# EAGLE design FUZZFACEA (EAGLE 8.6.3)
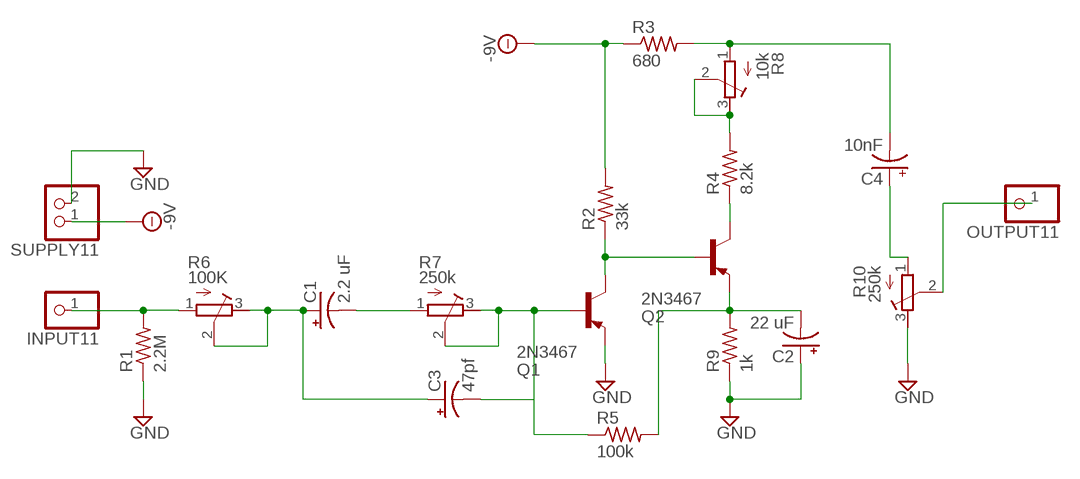
[diagram p0: schematic, sheet 1]

## Parts
C1  2.2 uF  CPOL-USTAP5-60  [TAP5-60]
C2  22 uF  CPOL-USTAP5-60  [TAP5-60]
C3  47pf  CPOL-USE2-4  [E2-4]
C4  10nF  CPOL-USE15-6AXIAL  [E15-6]
INPUT11  PINHD-1X1  [1X01]
OUTPUT11  PINHD-1X1  [1X01]
Q1  2N3467  [TO39]
Q2  2N3467  [TO39]
R1  2.2M  R-US_0411/12  [0411/12]
R2  33k  R-US_0411/12  [0411/12]
R3  680  R-US_0411/12  [0411/12]
R4  8.2k  R-US_0411/12  [0411/12]
R5  100k  R-US_0411/12  [0411/12]
R6  100K  R-TRIMM64X  [RTRIM64X]
R7  250k  R-TRIMM64X  [RTRIM64X]
R8  10k  R-TRIMM64X  [RTRIM64X]
R9  1k  R-US_0411/12  [0411/12]
R10  250k  R-TRIMM64X  [RTRIM64X]
SUPPLY11  PINHD-1X2  [1X02]

## Nets
-9V: R2.2 R3.1 SUPPLY11.1
GND: C2.+ Q1.1(E) R1.1 R9.1 R10.3(E) SUPPLY11.2
INPUT: INPUT11.1 R1.2 R6.1(A)
N1: C1.+ C3.+ R6.2(S) R6.3(E)
N2: C1.- R7.1(A)
N3: C3.- Q1.2(B) R5.1 R7.2(S) R7.3(E)
N4: C2.- Q2.1(E) R5.2 R9.2
N5: Q1.3(C) Q2.2(B) R2.1
N6: Q2.3(C) R4.1
N7: R4.2 R8.2(S) R8.3(E)
N8: C4.- R3.2 R8.1(A)
N9: C4.+ R10.1(A)
OUTPUT: OUTPUT11.1 R10.2(S)

## Library data of the parts
C1-C4 = rcl:CPOL-US: POLARIZED CAPACITOR, American symbol; SPICEPREFIX: C
INPUT11 OUTPUT11 = pinhead:PINHD-1X1: PIN HEADER
Q1 Q2 = transistor-pnp:2N3467*: PNP Transistror
R1-R5 R9 = rcl:R-US_: RESISTOR, American symbol; SPICEPREFIX: R
R6 R8 R10 = rcl:R-TRIMM: Trimm resistor; SPICEMODEL: X; SPICEPREFIXL: POT
R7 = rcl:R-TRIMM: Trimm resistor; SPICEMODEL: X; SPICEPREFIX: X; SPICEPREFIXL: POT
SUPPLY11 = pinhead:PINHD-1X2: PIN HEADER

## Board
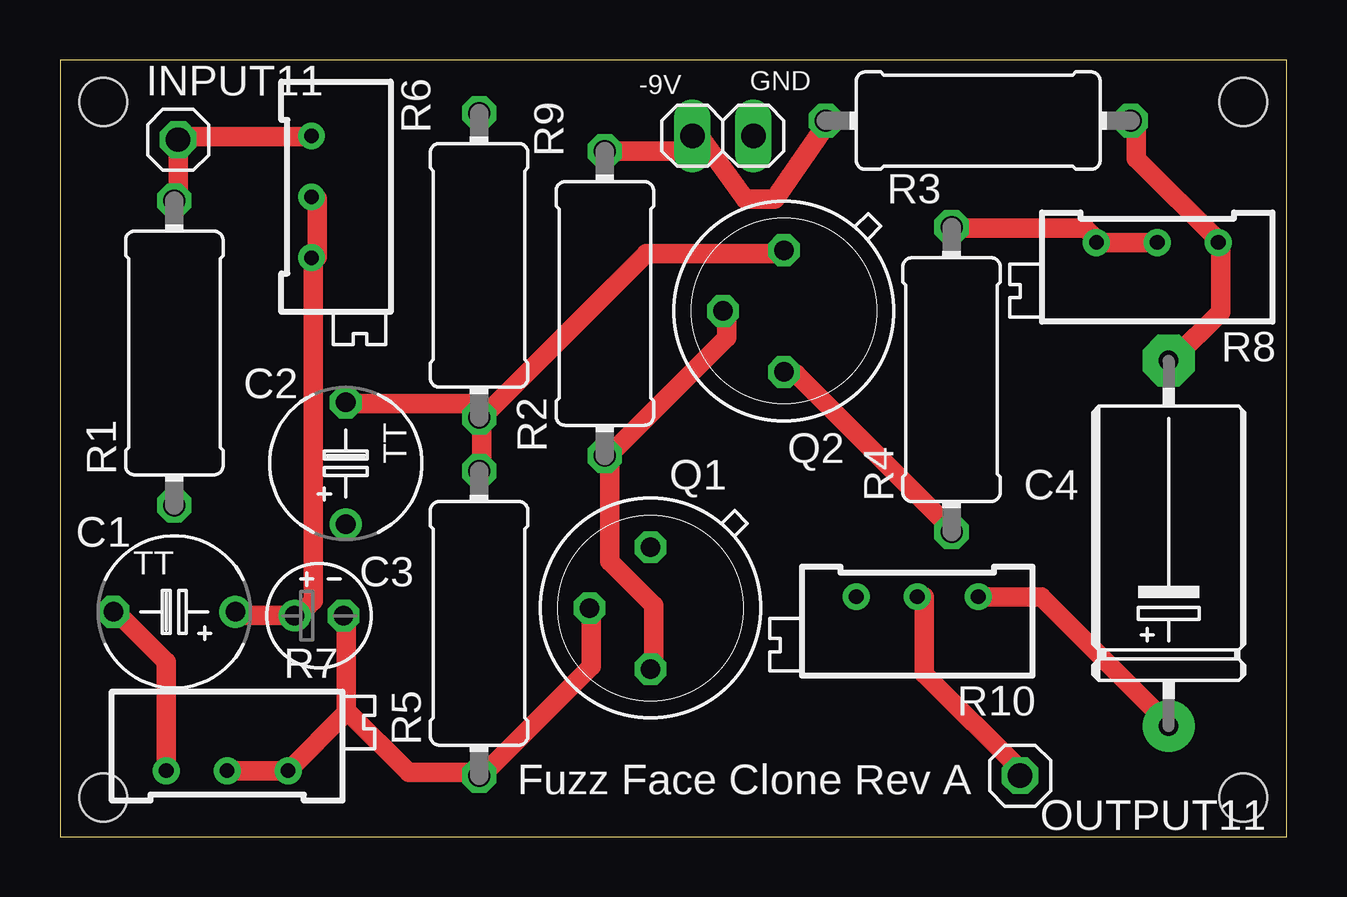
[diagram p1: board, top side]
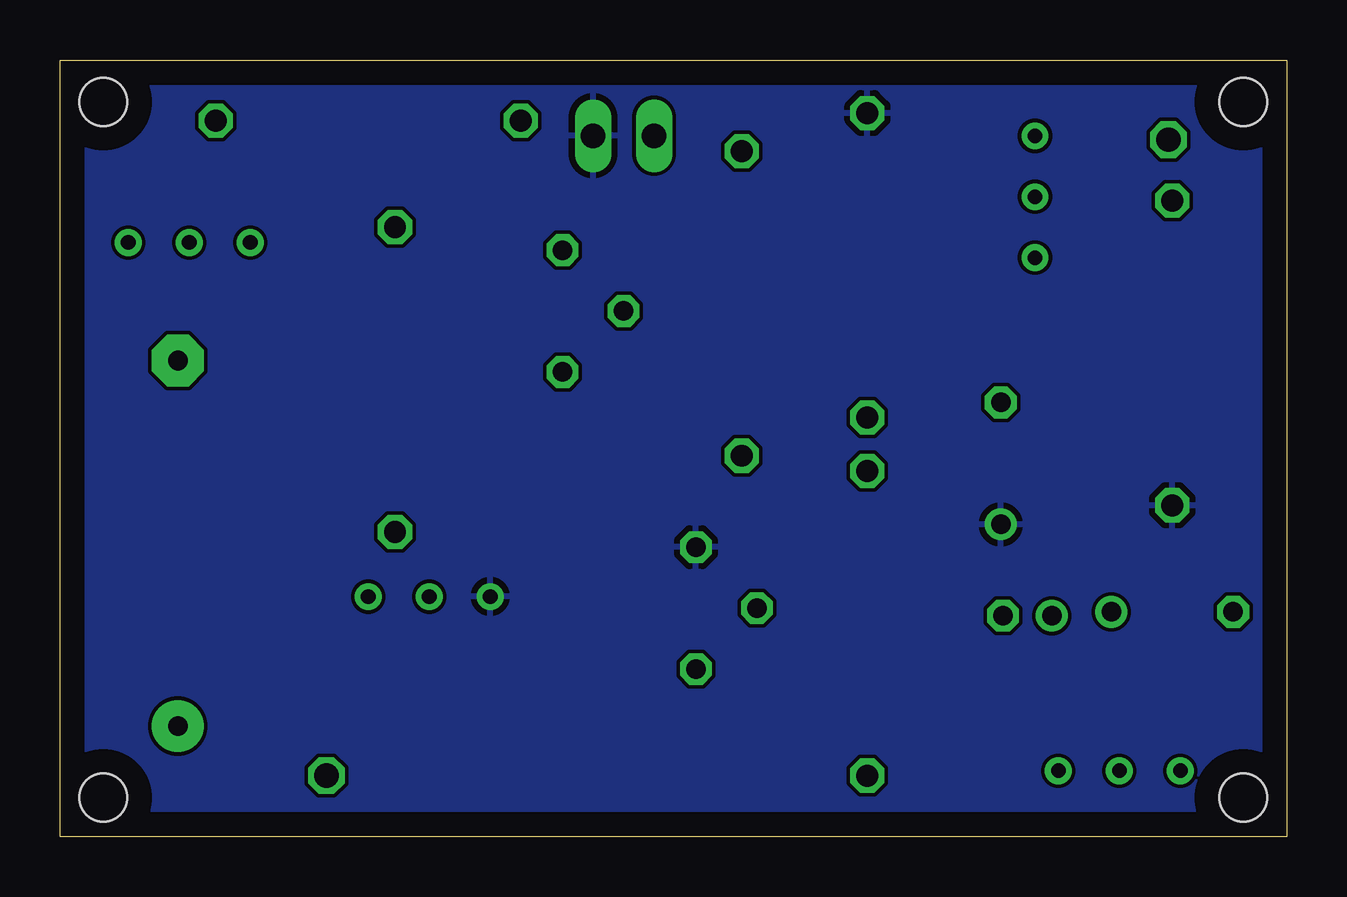
[diagram p2: board, bottom side, seen from below]

Size 51.11 x 32.38 mm. Coordinates in mm from the lower left corner, seen from the top.
Outline: 0,0 51.11,0 51.11,32.38 0,32.38 0,0
Copper layers (1*16): Top 0.035mm / dielectric 1.5mm / Bottom 0.035mm
Design rules "default": minimum track width 6mil, minimum drill 0.35mm, track to track 6mil, track to pad 6mil, pad to pad 6mil, via to via 6mil, smd to smd 6mil, copper to edge 40mil, drill to drill 6mil, minimum pad ring 10mil, minimum via ring 8mil, stop-mask expansion 4mil, vias tented up to drill 0mil, thermal gap 10mil
Holes 2 mm at 1.8,30.62 49.3,30.62 49.3,1.62 1.8,1.62

### Footprints (pad centres in the part's own frame; a part is rotated, then mirrored left to right if it is on the bottom)
TAP5-60 = drill 0.813: + -2.54,0 | drill 0.813 octagon: - 2.54,0
E2-4 = drill 0.813 pad 1.27: + -1.016,0 | drill 0.813 pad 1.27 octagon: - 1.016,0
E15-6 = drill 0.813 pad 2.159: + -7.62,0 | drill 0.813 pad 2.159 octagon: - 7.62,0
1X01 = drill 1.016 octagon: 1 0,0
TO39 = drill 0.813 octagon: 1 0,-2.54; 2 2.54,0; 3 0,2.54
0411/12 = drill 0.914 octagon: 1 -6.35,0; 2 6.35,0
RTRIM64X = drill 0.61: 1 1.27,-2.54; 2 1.27,0; 3 1.27,2.54
1X02 = drill 1.016 long: 1 -1.27,0; 2 1.27,0

### Placement (x,y rotation side)
C1  4.76,9.37 180 top
C2  11.91,15.56 90 top
C3  10.79,9.21 0 top
C4  46.2,12.22 90 top
INPUT11  4.92,29.05 0 top
OUTPUT11  40.01,2.54 0 top
Q1  24.61,9.52 180 top
Q2  30.16,21.91 180 top
R1  4.76,20.16 90 top
R2  22.7,22.22 90 top
R3  38.26,29.84 0 top
R4  37.15,19.05 90 top
R5  17.46,8.89 90 top
R6  11.75,26.67 180 top
R7  6.96,4.02 270 top
R8  45.72,23.5 90 top
R9  17.46,23.81 270 top
R10  35.72,8.73 90 top
SUPPLY11  27.62,29.21 0 top

### Tracks (layer width: path | path; a pad name or v marks a point on that pad's centre or on a via)
-9V
  Top 0.152: 22.9,28.58 R2.2 | 26.41,29.19 SUPPLY11.1 26.56,29.34 | 32.11,29.95 32.05,29.95 R3.1
  Top 0.813: 22.9,28.58 25.8,28.58 26.41,29.19 | 32.11,29.95 29.78,26.57 28.56,26.57 26.56,29.34
GND
  pour Bottom: 0,32.39 51.12,32.39 51.12,0 0,0
INPUT
  Top 0.152: 10.56,29.19 R6.1 | 5.23,29.19 INPUT11.1 5.07,29.03 4.92,28.88 | 4.92,26.59 R1.2
  Top 0.813: 5.23,29.19 10.56,29.19 | 4.92,28.88 4.92,26.59
N1
  Top 0.152: 10.71,24.16 R6.3 10.56,24 | 10.71,26.59 R6.2 | 7.51,9.22 C1.+ | 9.8,9.22 C3.+ 9.95,9.22
  Top 0.813: 10.71,26.59 10.71,24.16 | 9.8,9.22 7.51,9.22 | 10.56,24 10.56,9.83 9.95,9.22
N2
  Top 0.152: 2.48,9.22 C1.-
  Top 0.813: R7.1 4.43,7.28 2.48,9.22
N3
  Top 0.152: 22.14,9.52 Q1.2 | 17.72,2.67 R5.1 17.57,2.67 | 11.93,9.07 C3.-
  Top 0.813: 22.14,9.52 22.14,7.09 17.72,2.67 | 11.93,5.26 11.93,9.07 | 17.57,2.67 14.52,2.67 11.93,5.26 | R7.2 R7.3 11.93,5.17 11.93,5.26
N4
  Top 0.152: 17.11,18.06 17.57,17.6 R9.2 | 11.78,18.06 C2.- | 30.22,24.31 Q2.1 | 17.72,17.6 R9.2 | 17.57,15.32 R5.2 | 17.57,17.45 R9.2
  Top 0.813: 17.11,18.06 11.78,18.06 | 30.22,24.31 24.43,24.31 17.72,17.6 | 17.57,17.45 17.57,15.32
N5
  Top 0.152: 24.73,7.09 Q1.3 | 22.9,15.77 R2.1 22.9,15.93 | 27.78,21.87 Q2.2
  Top 0.813: 24.73,7.09 24.73,9.63 22.9,11.46 22.9,15.77 | 27.78,21.87 27.78,20.8 22.9,15.93
N6
  Top 0.152: 30.68,19.28 30.37,19.28 Q2.3 | 37.23,12.73 R4.1
  Top 0.813: 37.23,12.73 30.68,19.28
N7
  Top 0.152: 43.48,24.77 R8.3 43.33,24.77 | 45.76,24.77 R8.2 | 37.38,25.38 R4.2
  Top 0.813: 45.76,24.77 43.48,24.77 | 37.38,25.38 42.72,25.38 43.33,24.77
N8
  Top 0.152: 46.37,19.89 C4.- | 44.85,29.79 R3.2 | 48.36,24.77 R8.1 48.36,24.77
  Top 0.813: 46.37,19.89 48.36,21.87 48.36,24.77 44.85,28.27 44.85,29.79
N9
  Top 0.152: 38.45,9.98 R10.1 | 46.22,4.65 C4.+
  Top 0.813: 38.45,9.98 40.89,9.98 46.22,4.65
OUTPUT
  Top 0.152: 36.01,9.98 R10.2 | 40.13,2.67 OUTPUT11.1
  Top 0.813: 36.01,9.98 36.01,6.78 40.13,2.67

### Text on the board
tNames: -9V | GND | Fuzz Face Clone Rev A